# Altium project Toygether_PCB_Project.PrjPCB
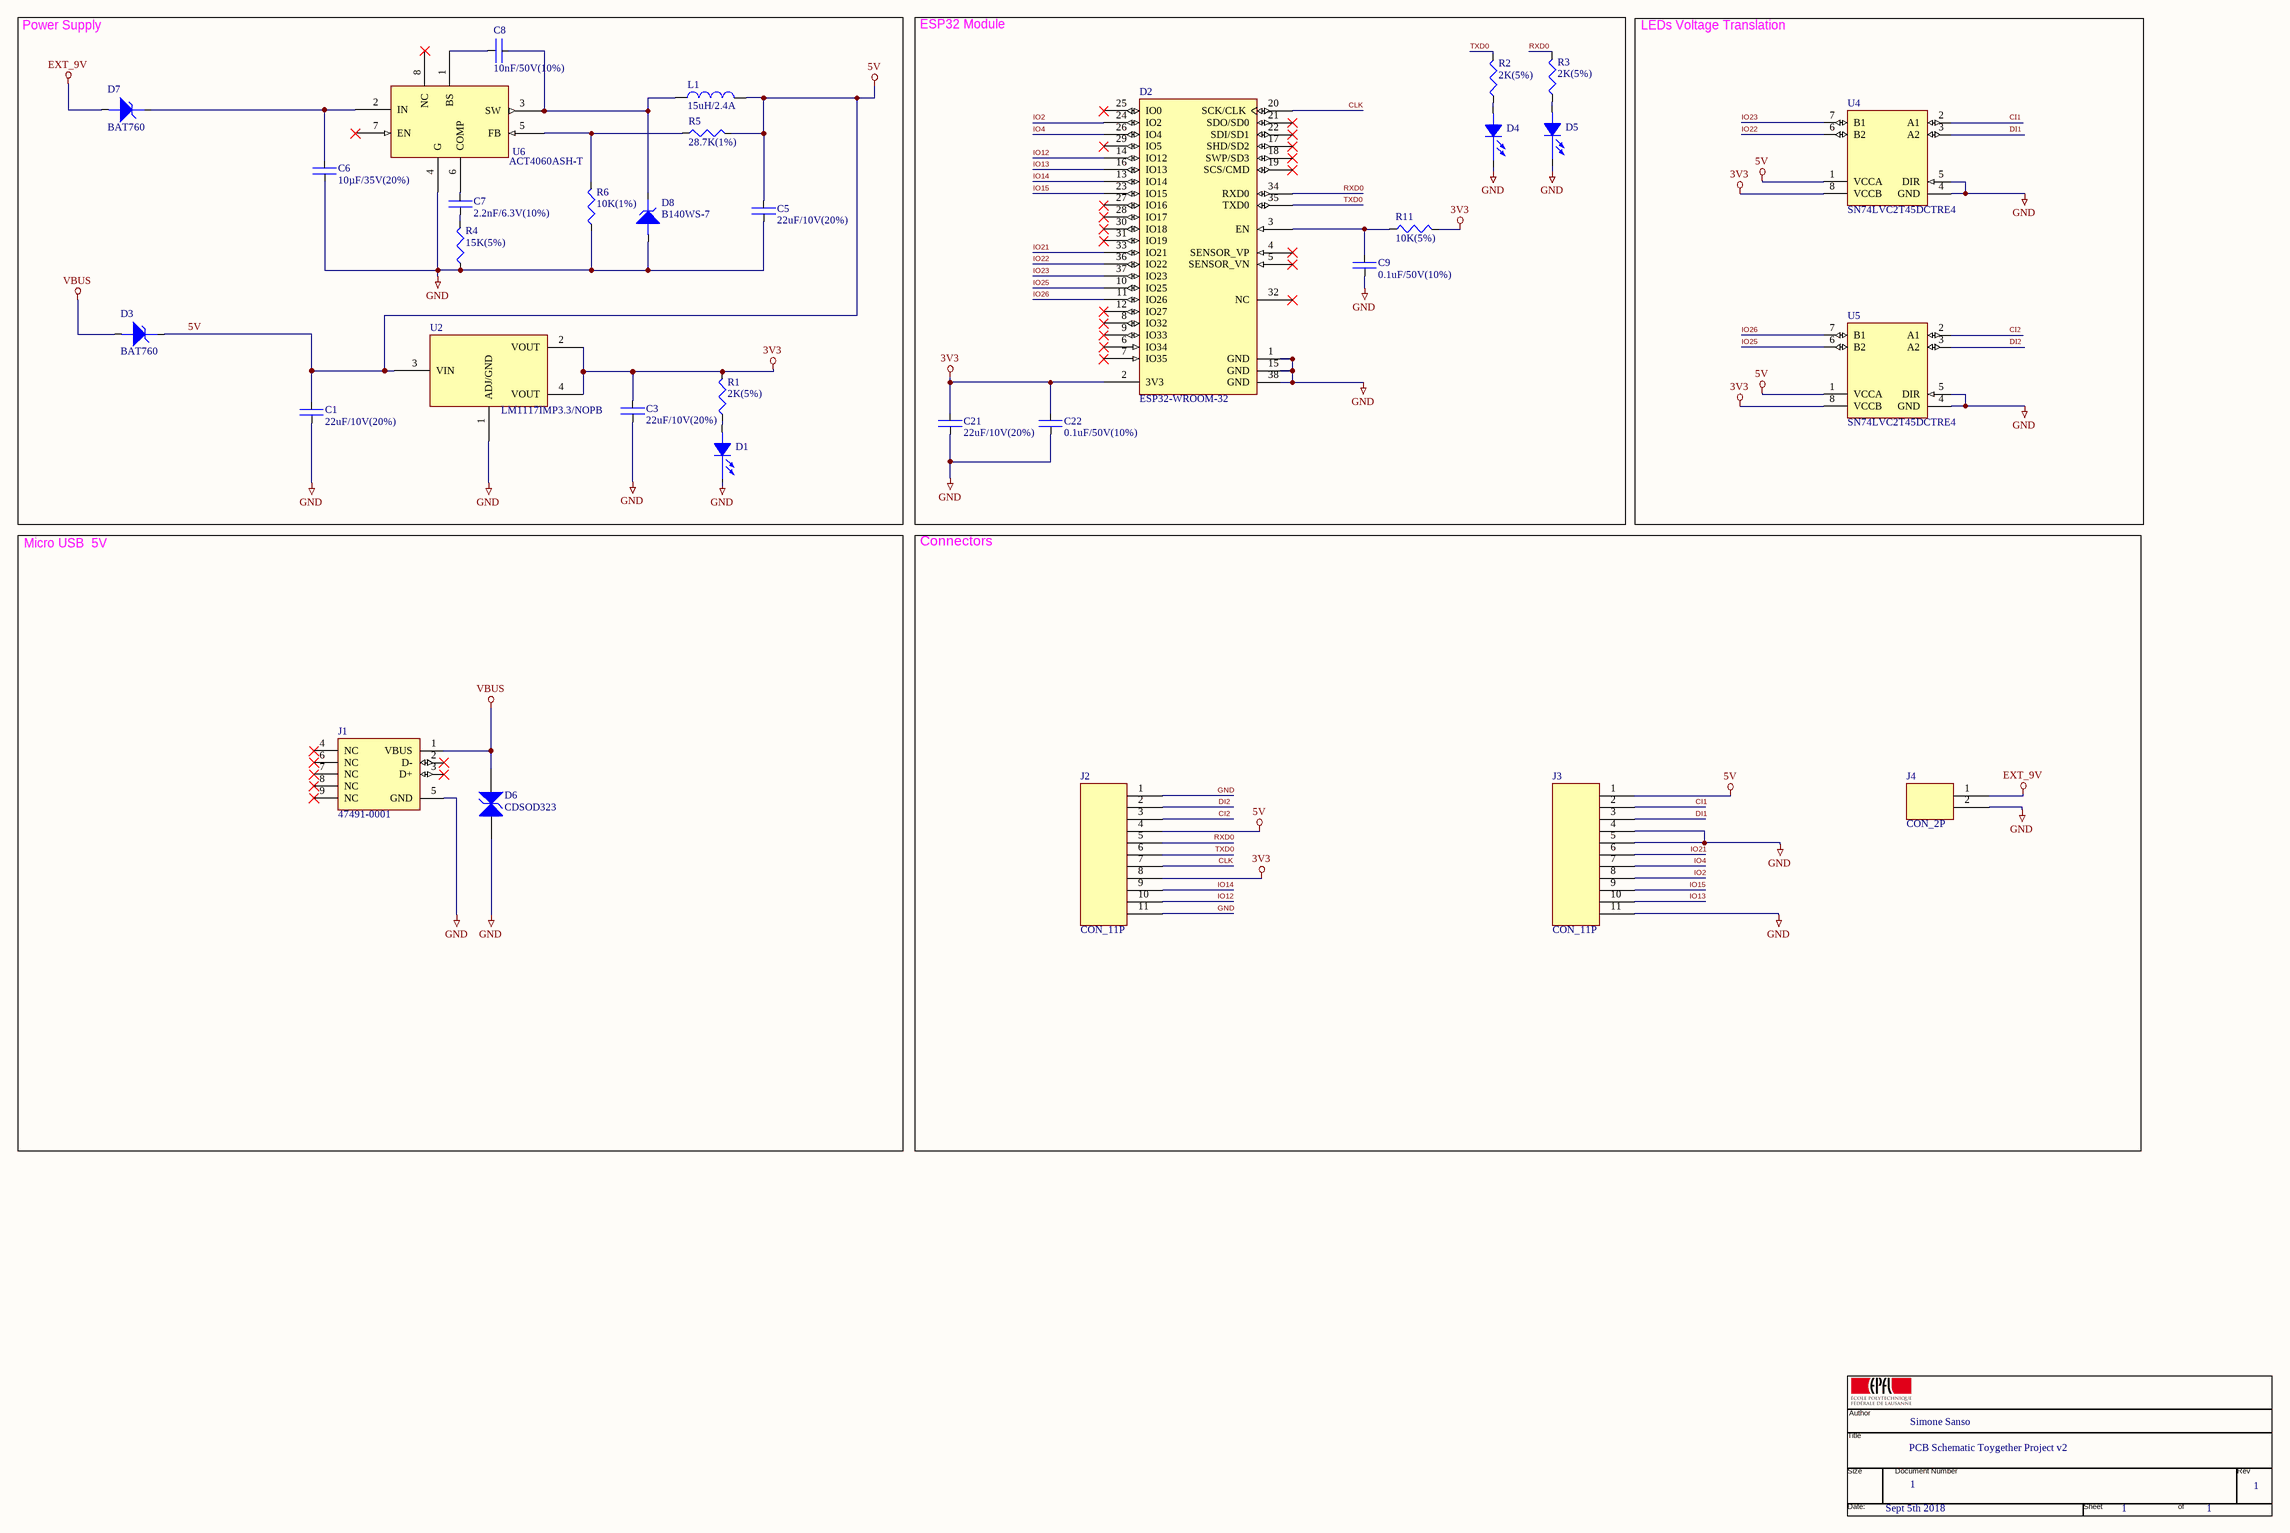
[diagram p0: Toygether_Sch.SchDoc]
1 sheet, 34 parts. Net scope: global (net labels, ports and power ports of the same name join across sheets).
Board file: Toygether_PCB.PcbDoc

## Sheet Toygether_Sch.SchDoc
size 513 x 386 mm

### Parts
C1  22uF/10V(20%)  [CAPC0603]
C3  22uF/10V(20%)  [CAPC0603]
C5  22uF/10V(20%)  [CAPC0603]
C6  10µF/35V(20%)  [CAPC0603]
C7  2.2nF/6.3V(10%)  [CAPC0603]
C8  10nF/50V(10%)  [CAPC0603]
C9  0.1uF/50V(10%)  [CAPC0603]
C21  22uF/10V(20%)  [CAPC0603]
C22  0.1uF/50V(10%)  [CAPC0603]
D1  SML-D12U1WT86  [SML-D12U1WT86]  (value not drawn)
D2  ESP32-WROOM-32  [OLMX-ESP-WROOM-32]
D3  BAT760  [SOD-323-SCHOTTKY_DIODE-30V/0.5A]
D4  SML-D12U1WT86  [SML-D12U1WT86]  (value not drawn)
D5  SML-D12U1WT86  [SML-D12U1WT86]  (value not drawn)
D6  CDSOD323  [SOD-323-SCHOTTKY_DIODE-30V/0.5A]
D7  BAT760  [SOD-323-SCHOTTKY_DIODE-30V/0.5A]
D8  B140WS-7  [SOD-323-SCHOTTKY_DIODE-40V/1A]
J1  47491-0001  [USB-MICRO-B_V]
J2  CON_11P  [PINS_HEADER-11]
J3  CON_11P  [PINS_HEADER-11]
J4  CON_2P  [PINS_ALIM-2]
L1  15uH/2.4A  [NRS8040-SELF-15uH/2.4A]
R1  2K(5%)  [RC0402]
R2  2K(5%)  [RC0402]
R3  2K(5%)  [RC0402]
R4  15K(5%)  [RC0402]
R5  28.7K(1%)  [RC0402]
R6  10K(1%)  [RC0402]
R11  10K(5%)  [RC0402]
T  TITLE_BLOCK  (value not drawn)
U2  LM1117IMP3.3/NOPB  [LM1117]
U4  SN74LVC2T45DCTRE4  [VOLTAGE_TRANSLATOR_3.3-5V]
U5  SN74LVC2T45DCTRE4  [VOLTAGE_TRANSLATOR_3.3-5V]
U6  ACT4060ASH-T  [SWITCHING_VOLTAGE_REGULATOR]

### Blocks framed on the sheet
Power Supply: C1 C3 C5-C8 D1 D3 D7 D8 L1 R1 R4-R6 U2 U6
ESP32 Module: C9 C21 C22 D2 D4 D5 R2 R3 R11
LEDs Voltage Translation: U4 U5
Micro USB  5V: D6 J1
Connectors: J2-J4

### Nets
3V3: C3.2 C21.2 C22.2 D2.2(3V3) J2.8 R1.2 R11.2 U2.2(VOUT) U2.4(VOUT) U4.8(VCCB) U5.8(VCCB)
5V: C1.2 C5.2 D3.2(K) J2.4 J3.1 L1.2 R5.2 U2.3(VIN) U4.1(VCCA) U5.1(VCCA)
EXT_9V: D7.1(A) J4.1(VIN)
GND: C1.1 C3.1 C5.1 C6.1 C9.1 C21.1 C22.1 D1.2 D2.1(GND) D2.15(GND) D2.38(GND) D4.2 D5.2 D6.1(C) D8.1(A) J1.5(GND) J2.1 J2.11 J3.4 J3.5 J3.11 J4.2(GND) R4.1 R6.1 U2.1(ADJ/GND) U4.4(GND) U4.5(DIR) U5.4(GND) U5.5(DIR) U6.4(G)
VBUS: D3.1(A) D6.2(C) J1.1(VBUS)
CI1: J3.2 U4.2(A1)
CI2: J2.3 U5.2(A1)
CLK: D2.20(SCK/CLK) J2.7
DI1: J3.3 U4.3(A2)
DI2: J2.2 U5.3(A2)
IO2: D2.24(IO2) J3.8
IO4: D2.26(IO4) J3.7
IO12: D2.14(IO12) J2.10
IO13: D2.16(IO13) J3.10
IO14: D2.13(IO14) J2.9
IO15: D2.23(IO15) J3.9
IO21: D2.33(IO21) J3.6
IO22: D2.36(IO22) U4.6(B2)
IO23: D2.37(IO23) U4.7(B1)
IO25: D2.10(IO25) U5.6(B2)
IO26: D2.11(IO26) U5.7(B1)
RXD0: D2.34(RXD0) J2.5 R3.2
TXD0: D2.35(TXD0) J2.6 R2.2
NetC6_2: C6.2 D7.2(K) U6.2(IN)
NetC7_1: C7.1 R4.2
NetC7_2: C7.2 U6.6(COMP)
NetC8_1: C8.1 U6.1(BS)
NetC8_2: C8.2 D8.2(K) L1.1 U6.3(SW)
NetC9_2: C9.2 D2.3(EN) R11.1
NetD1_1: D1.1 R1.1
NetD4_1: D4.1 R2.1
NetD5_1: D5.1 R3.1
NetR5_1: R5.1 R6.2 U6.5(FB)

Not connected (* = marked no-connect by the designer): D2 4(SENSOR_VP)* 5(SENSOR_VN)* 6(IO34)* 7(IO35)* 8(IO32)* 9(IO33)* 12(IO27)* 17(SHD/SD2)* 18(SWP/SD3)* 19(SCS/CMD)* 21(SDO/SD0)* 22(SDI/SD1)* 25(IO0)* 27(IO16)* 28(IO17)* 29(IO5)* 30(IO18)* 31(IO19)* 32(NC)*; J1 2(D-)* 3(D+)* 4(NC)* 6(NC)* 7(NC)* 8(NC)* 9(NC)*; U6 7(EN)* 8(NC)*

### Notes on the sheet
- (in symbol RED_LED) (A); (K)

### Library data of the parts
C1 C3 C5 C21 = CAP-22uF/10V(20%): GRM188R61A226ME15D-22uF/10V(20%); Supplier 1: Digi-Key; Supplier Part Number 1: 490-10476-6-ND
C6 = CAP-10µF/35V(20%): C0603C106M8PACTU; Supplier 1: Mouser; Supplier Part Number 1: 80-C0603C106M8PACTU
C7 = CAP-2.2nF/6.3V(10%): C0603X7R0J222K030BA; Supplier 1: Mouser; Supplier Part Number 1: 810-C0603X7R0J222K0A
C8 = CAP-10nF/50V(10%): C1608X7R1H103K080AE; Supplier 1: Mouser; Supplier Part Number 1: 810-C1608X7R1H103KAE
C9 C22 = CAP-0.1uF/50V(10%): GRM188R71H104KA93D-0.1uF/50V(10%); Supplier 1: Distrelec; Supplier Part Number 1: 16520001
D1 D4 D5 = RED_LED: SML-D12U1WT86-2.2V-20mA; Supplier 1: Mouser; Supplier Part Number 1: 755-SML-D12U1WT86
D2 = ESP-WROOM-32: Supplier 1: Mouser; Supplier Part Number 1: 356-ESP-WROOM-32
D3 D7 = SCHOTTKY_DIODE-30V/0.5A: BAT760-7-Schottky Diodes & Rectifiers 0.5A 30V LF; Supplier 1: Avnet; Supplier Part Number 1: BAT760-7/BKN
D6 = BIDIRECTIONAL_DIODE: CDSOD323-T05LC - ESD Suppressors / TVS Diodes Bidirectional Ultra Low Cap; Supplier 1: Mouser; Supplier Part Number 1: 652-CDSOD323-T05LC
D8 = SCHOTTKY_DIODE-40V/3A: Diode Schottky 40V 1A 2-Pin SOD-323 T/R; Supplier 1: Mouser; Supplier Part Number 1: 621-B140WS-7
J1 = USB_CON8: USB Connectors MICRO USB B RECPT MIDDLE MNT ASSY; Supplier 1: Distrelec; Supplier Part Number 1: 30076400
J2 J3 = PINS_HEADER_11: 11 Positions Header, Breakaway Connector 0.100" (2.54mm) Through Hole Tin
J4 = PIN_ALIM: 2 Positions Header, Breakaway Connector 0.100" (2.54mm) Through Hole Tin
L1 = SELF-15uH/2.4A: NRS8040T150MJGJ; Supplier 1: Mouser; Supplier Part Number 1: 963-NRS8040T150MJGJ
R1-R3 = RESISTOR-2K(5%): RC0402JR-072KL; Supplier 1: Newark; Supplier Part Number 1: 67R9979
R4 = RESISTOR-15K(5%): RC0402JR-0715KL; Supplier 1: Newark; Supplier Part Number 1: 67R9973
R5 = RESISTOR-28.7K(1%): RC0402JR-072K7L; Supplier 1: Newark; Supplier Part Number 1: 67R9981
R6 = RESISTOR-10K(1%): RC0402F103CS; Supplier 1: Digi-Key; Supplier Part Number 1: 1276-3530-6-ND
R11 = RESISTOR-10K(5%): RC0402JR-0710KL; Supplier 1: Newark; Supplier Part Number 1: 67R9964
U2 = LM1117-3.3: Supplier 1: Distrelec; Supplier Part Number 1: 173-06-781
U4 U5 = VOLTAGE_TRANSLATOR_3.3-5V: Translation - Voltage Levels DUAL-BIT DUAL SUPPLY TRANSCEIVER; Supplier 1: Farnell; Supplier Part Number 1: 9592768
U6 = SWITCHING_VOLTAGE_REGULATOR: Supplier 1: Mouser; Supplier Part Number 1: 107-ACT4060ASH-T